# EAGLE schematic UltrasonicSensor (EAGLE 9.5.2)
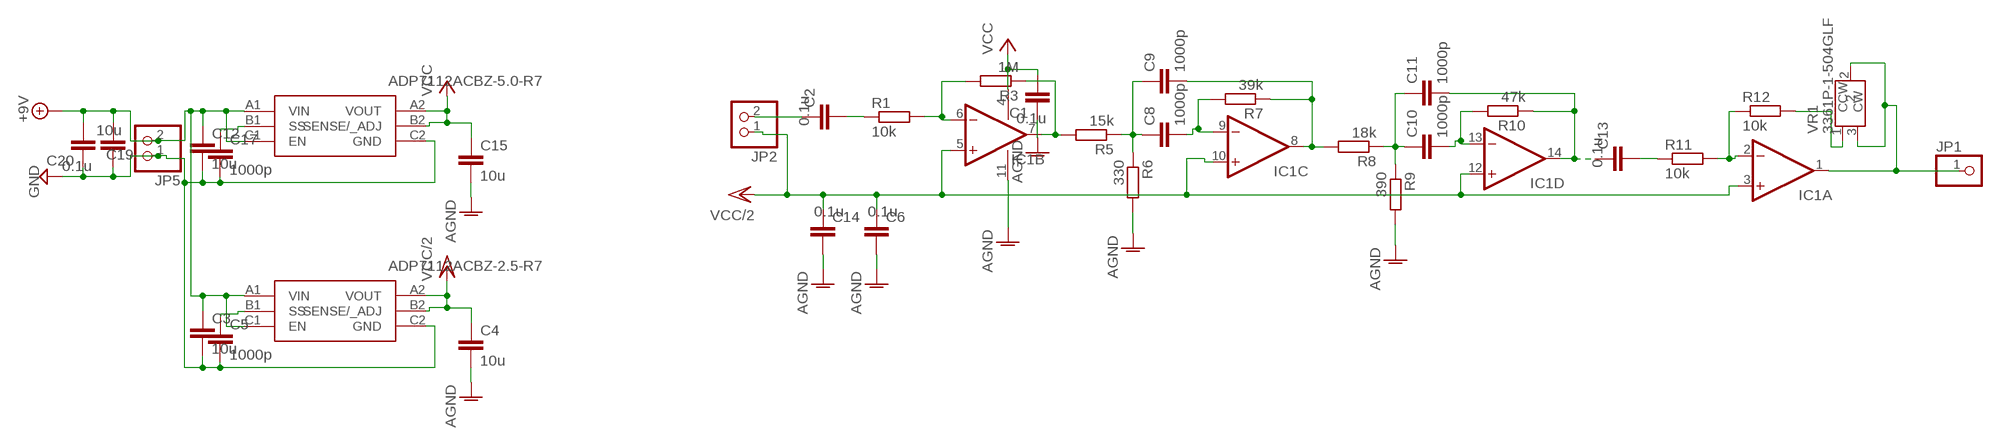
[diagram p0: schematic, sheet 1]

## Parts
C1  0.1u  C-EUC1608  [C1608]
C2  0.1u  C-EUC1608  [C1608]
C3  10u  C-EUC2012  [C2012]
C4  10u  C-EUC2012  [C2012]
C5  1000p  C-EUC1608  [C1608]
C6  0.1u  C-EUC1608  [C1608]
C8  1000p  C-EUC1608  [C1608]
C9  1000p  C-EUC1608  [C1608]
C10  1000p  C-EUC1608  [C1608]
C11  1000p  C-EUC1608  [C1608]
C12  10u  C-EUC2012  [C2012]
C13  0.1u  C-EUC1608  [C1608]
C14  0.1u  C-EUC1608  [C1608]
C15  10u  C-EUC2012  [C2012]
C17  1000p  C-EUC1608  [C1608]
C19  10u  C-EUC2012  [C2012]
C20  0.1u  C-EUC1608  [C1608]
IC1  NJM2734M  [NJM2734M]
JP1  PINHD-1X1  [1X01]
JP2  PINHD-1X2  [1X02]
JP5  PINHD-1X2  [1X02]
PS1  ADP7112ACBZ-2.5-R7  ADP7112ACBZ-3.3-R7  [BGA6C40P2X3_95X116X56]
PS2  ADP7112ACBZ-5.0-R7  ADP7112ACBZ-3.3-R7  [BGA6C40P2X3_95X116X56]
R1  10k  R-EU_R0603  [R0603]
R3  1M  R-EU_R0603  [R0603]
R5  15k  R-EU_R0603  [R0603]
R6  330  R-EU_R0603  [R0603]
R7  39k  R-EU_R0603  [R0603]
R8  18k  R-EU_R0603  [R0603]
R9  390  R-EU_R0603  [R0603]
R10  47k  R-EU_R0603  [R0603]
R11  10k  R-EU_R0603  [R0603]
R12  10k  R-EU_R0603  [R0603]
VR1  3361P-1-504GLF  [3361P1253GLF]

## Nets
+9V [power]: C3.1 C12.1 C19.2 C20.2 JP5.2 PS1.A1(VIN) PS1.C1(EN) PS2.A1(VIN) PS2.C1(EN)
AGND [power]: C1.1 C4.2 C6.2 C14.2 C15.2 IC1.11(P:V-) R6.2 R9.2
GND [power]: C3.2 C5.2 C12.2 C17.2 C19.1 C20.1 JP5.1 PS1.C2(GND) PS2.C2(GND)
N$2: C13.2 R11.1
N$3: C2.2 R1.1
N$4: C2.1 JP2.2
N$5: IC1.6(B:-IN) R1.2 R3.2
N$6: C5.1 PS1.B1(SS)
N$7: C8.1 C9.1 R5.1 R6.1
N$8: C8.2 IC1.9(C:-IN) R7.2
N$9: IC1.2(A:-IN) R11.2 R12.1
N$10: IC1.7(B:OUT) R3.1 R5.2
N$11: C9.2 IC1.8(C:OUT) R7.1 R8.2
N$12: C10.1 C11.1 R8.1 R9.1
N$13: C10.2 IC1.13(D:-IN) R10.2
N$14: C11.2 C13.1 IC1.14(D:OUT) R10.1
N$15: R12.2 VR1.1(CCW)
N$16: IC1.1(A:OUT) JP1.1 VR1.2 VR1.3(CW)
N$34: C17.1 PS2.B1(SS)
VCC [power]: C1.2 C15.1 IC1.4(P:V+) PS2.A2(VOUT) PS2.B2(SENSE/_ADJ)
VCC/2 [power]: C4.1 C6.1 C14.1 IC1.3(A:+IN) IC1.5(B:+IN) IC1.10(C:+IN) IC1.12(D:+IN) JP2.1 PS1.A2(VOUT) PS1.B2(SENSE/_ADJ)

## Library data of the parts
C1-C6 C8-C15 C17 C19 C20 = rcl:C-EU: CAPACITOR, European symbol; SPICEPREFIX: C
IC1 = linear3:NJM2734M: OP AMP
JP1 = pinhead:PINHD-1X1: PIN HEADER
JP2 JP5 = pinhead:PINHD-1X2: PIN HEADER
PS1 PS2 = ADP7112ACBZ-3.3-R7:ADP7112ACBZ-3.3-R7: LDO Voltage Regulators 20V 200mA LDO 3.3Vo Source: Datasheet <https://www.analog.com/media/en/technical-documentation/data-sheets/ADP7112.pdf>; ARROW_PART_NUMBER: ADP7112ACBZ-3.3-R7; DESCRIPTION: LDO Voltage Regulators 20V 200mA LDO 3.3Vo; HEIGHT: 0.56mm; MANUFACTURER_NAME: Linear Technology; MANUFACTURER_PART_NUMBER: ADP7112ACBZ-3.3-R7; MOUSER_PART_NUMBER: 584-ADP7112ACBZ3.3R7; MOUSER_PRICE-STOCK: https://www.mouser.com/Search/Refine.aspx?Keyword=584-ADP7112ACBZ3.3R7
R1 R3 R5-R12 = rcl:R-EU_: RESISTOR, European symbol; SPICEPREFIX: R
VR1 = 3361P-1-504GLF:3361P-1-504GLF: BOURNS - 3361P-1-504GLF - Product Range:AEC-Q200 3361P Series Source: Datasheet <https://www.bourns.com/docs/Product-Datasheets/3361.pdf>; DESCRIPTION: BOURNS - 3361P-1-504GLF - Product Range:AEC-Q200 3361P Series; HEIGHT: 5.84mm; MANUFACTURER_NAME: Bourns; MANUFACTURER_PART_NUMBER: 3361P-1-504GLF; MOUSER_PART_NUMBER: 652-3361P-1-504GLF; MOUSER_PRICE-STOCK: https://www.mouser.co.uk/ProductDetail/Bourns/3361P-1-504GLF?qs=fqIB%2FsSTfTaKxcvNNIdl2Q%3D%3D

## Net classes
0 default: width 0.61 mm, clearance 0.254 mm
1 power: width 0.61 mm, clearance 0.254 mm